# Altium schematic sheet Sheet1.SchDoc
size A3; SheetNumber: 2; SheetTotal: 2
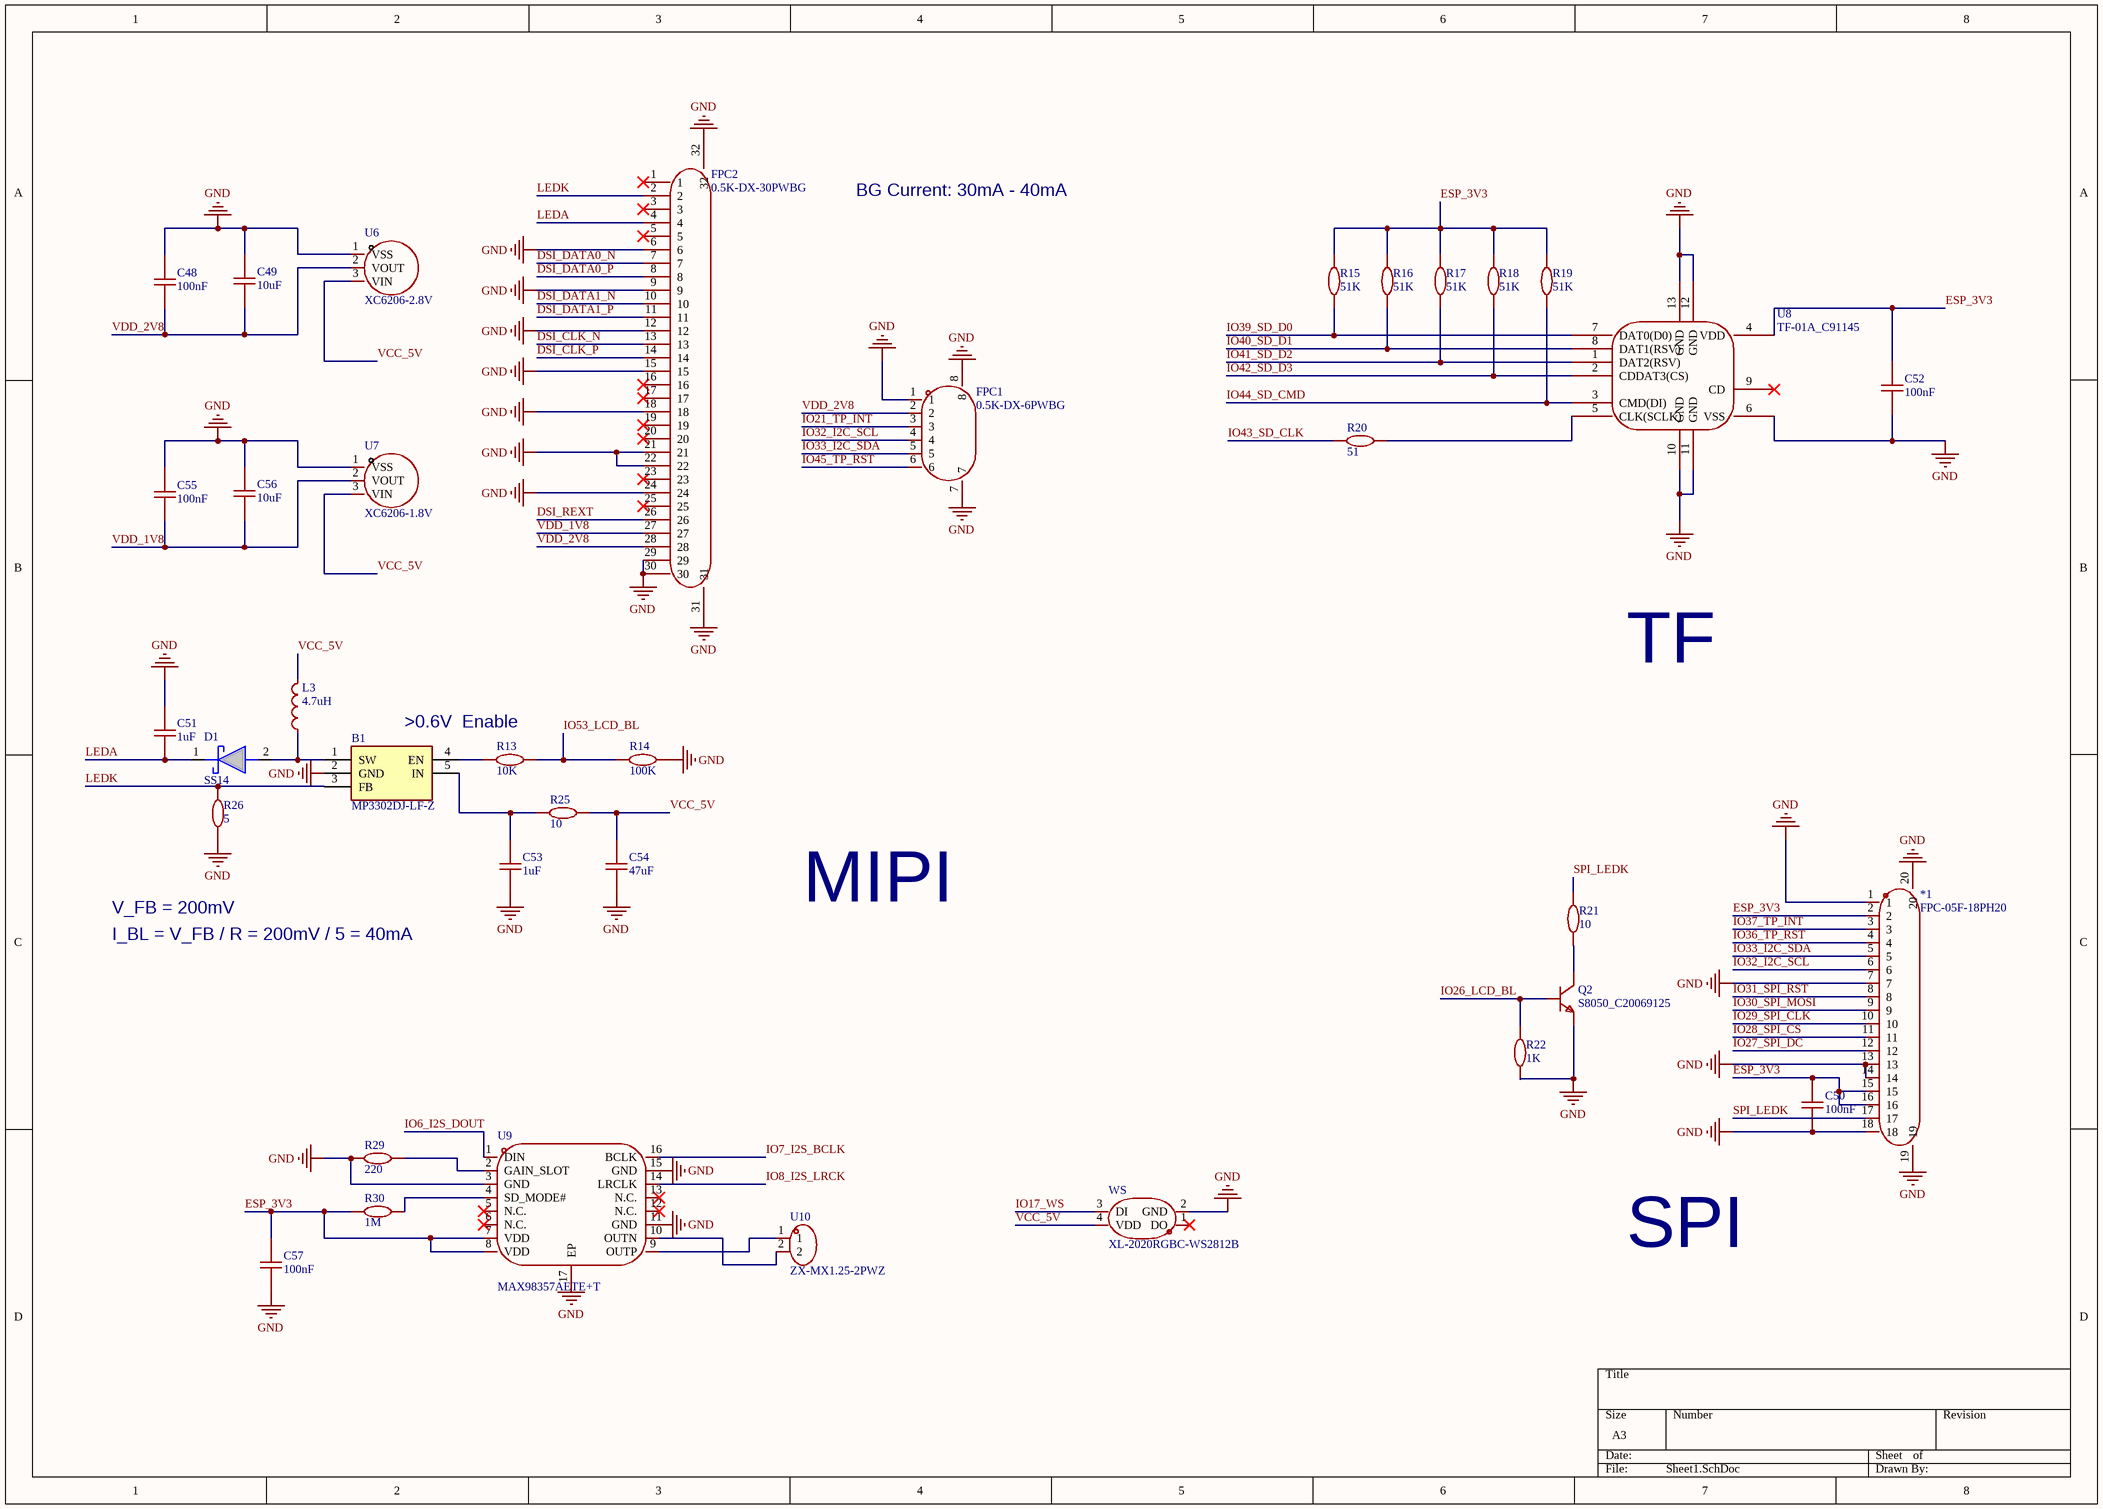
[diagram p0: Sheet1.SchDoc]

## Parts
*1  FPC-05F-18PH20  [FPC-SMD_18P-P0.50_FPC-05F-18PH20]
B1  MP3302DJ-LF-Z  [SOT95P280X100-5N]
C48  100nF  [C0402]
C49  10uF  [C0603]
C50  100nF  [C0402]
C51  1uF  [C0402]
C52  100nF  [C0402]
C53  1uF  [C0402]
C54  47uF  [C0603]
C55  100nF  [C0402]
C56  10uF  [C0603]
C57  100nF  [C0402]
D1  SS14  [DIOM5126X250N]
FPC1  0.5K-DX-6PWBG  [FPC-SMD_6P-P0.50_DEALON_0.5K-DX-6PWB]
FPC2  0.5K-DX-30PWBG  [FPC-SMD_6P-P0.50_DEALON_0.5K-DX-30PWB]
L3  4.7uH  [L0402-SMD]
Q2  S8050_C20069125  [SOT-23-3_L2.9-W1.3-P1.90-LS2.3-BR]
R13  10K  [R0402]
R14  100K  [R0402]
R15  51K  [R0402]
R16  51K  [R0402]
R17  51K  [R0402]
R18  51K  [R0402]
R19  51K  [R0402]
R20  51  [R0402]
R21  10  [R0402]
R22  1K  [R0402]
R25  10  [R0402]
R26  5  [R0402]
R29  220  [R0402]
R30  1M  [R0402]
U6  XC6206-2.8V  [SOT-23-3_L2.9-W1.6-P1.90-LS2.8-BR]
U7  XC6206-1.8V  [SOT-23-3_L2.9-W1.6-P1.90-LS2.8-BR]
U8  TF-01A_C91145  [TF-SMD_TF-01A]
U9  MAX98357AETE+T  [TQFN-16_L3.0-W3.0-P0.50-BL-EP1.5]
U10  ZX-MX1.25-2PWZ  [CONN-TH_2P-P1.25_ZX-MX1.25-2PWZ]
WS  XL-2020RGBC-WS2812B  [LED-SMD_4P-L2.0-W2.0-BR-1]

## Nets
GND: *1.1 *1.7 *1.13 *1.14 *1.18 *1.19 *1.20 B1.2(GND) C48.2 C49.2 C50.1 C51.2 C52.1 C53.1 C54.1 C55.2 C56.2 C57.1 FPC1.1 FPC1.7 FPC1.8 FPC2.6 FPC2.9 FPC2.12 FPC2.15 FPC2.18 FPC2.21 FPC2.22 FPC2.24 FPC2.29 FPC2.30 FPC2.31 FPC2.32 Q2.2(E) R14.1 R22.1 R26.2 R29.1 U6.1(VSS) U7.1(VSS) U8.6(VSS) U8.10(GND) U8.11(GND) U8.12(GND) U8.13(GND) U9.3(GND) U9.11(GND) U9.15(GND) U9.17(EP) WS.2(GND)
DSI_CLK_N: FPC2.13
DSI_CLK_P: FPC2.14
DSI_DATA0_N: FPC2.7
DSI_DATA0_P: FPC2.8
DSI_DATA1_N: FPC2.10
DSI_DATA1_P: FPC2.11
DSI_REXT: FPC2.26
ESP_3V3: *1.2 *1.15 *1.16 C50.2 C52.2 C57.2 R15.1 R16.1 R17.1 R18.1 R19.1 R30.1 U8.4(VDD) U9.7(VDD) U9.8(VDD)
IO6_I2S_DOUT: U9.1(DIN)
IO7_I2S_BCLK: U9.16(BCLK)
IO8_I2S_LRCK: U9.14(LRCLK)
IO17_WS: WS.3(DI)
IO21_TP_INT: FPC1.3
IO26_LCD_BL: Q2.1(B) R22.2
IO27_SPI_DC: *1.12
IO28_SPI_CS: *1.11
IO29_SPI_CLK: *1.10
IO30_SPI_MOSI: *1.9
IO31_SPI_RST: *1.8
IO32_I2C_SCL: *1.6 FPC1.4
IO33_I2C_SDA: *1.5 FPC1.5
IO36_TP_RST: *1.4
IO37_TP_INT: *1.3
IO39_SD_D0: R15.2 U8.7(DAT0(D0))
IO40_SD_D1: R16.2 U8.8(DAT1(RSV))
IO41_SD_D2: R17.2 U8.1(DAT2(RSV))
IO42_SD_D3: R18.2 U8.2(CDDAT3(CS))
IO43_SD_CLK: R20.1
IO44_SD_CMD: R19.2 U8.3(CMD(DI))
IO45_TP_RST: FPC1.6
IO53_LCD_BL: R13.1 R14.2
LEDA: C51.1 D1.1(K) FPC2.4
LEDK: B1.3(FB) FPC2.2 R26.1
SPI_LEDK: *1.17 R21.2
VCC_5V: C54.2 L3.2 R25.1 U6.3(VIN) U7.3(VIN) WS.4(VDD)
VDD_1V8: C55.1 C56.1 FPC2.27 U7.2(VOUT)
VDD_2V8: C48.1 C49.1 FPC1.2 FPC2.28 U6.2(VOUT)
NetB1_1: B1.1(SW) D1.2(A) L3.1
NetB1_4: B1.4(EN) R13.2
NetB1_5: B1.5(IN) C53.2 R25.2
NetQ2_3: Q2.3(C) R21.1
NetR20_2: R20.2 U8.5(CLK(SCLK))
NetR29_2: R29.2 U9.2(GAIN_SLOT)
NetR30_2: R30.2 U9.4(SD_MODE#)
NetU9_9: U9.9(OUTP) U10.1
NetU9_10: U9.10(OUTN) U10.2

Not connected (* = marked no-connect by the designer): FPC2 1* 3* 5* 16* 17* 19* 20* 23* 25*; U8 9(CD)*; U9 5(N.C.)* 6(N.C.)* 12(N.C.)* 13(N.C.)*; WS 1(DO)*

## Notes on the sheet
- BG Current: 30mA - 40mA
- TF
- >0.6V  Enable
- V_FB = 200mV
- MIPI
- I_BL = V_FB / R = 200mV / 5 = 40mA
- SPI

## Library data of the parts
B1 = MP3302DJ-LF-Z: LED Lighting Drivers 1.3A, 1.3MHz WLED Driver; Manufacturer_Name: Monolithic Power Systems (MPS); Geometry.Height: 1mm; Mouser Part Number: 946-MP3302DJLFZ; Mouser Price/Stock: https://www.mouser.co.uk/ProductDetail/Monolithic-Power-Systems-MPS/MP3302DJ-LF-Z?qs=rC7bBWoQAAmgkwFvMFHCAg%3D%3D; Manufacturer_Part_Number: MP3302DJ-LF-Z; Datasheet Link: https://componentsearchengine.com/Datasheets/1/MP3302DJ-LF-Z.pdf
C48 C50-C53 C55 C57 = C0402
C49 C54 C56 = C0603
D1 = SS14: TAIWAN SEMICONDUCTOR - SS14 - SCHOTTKY RECTIFIER, 1A, 40V, DO-214AC; Geometry.Height: 2.5mm; Mouser Part Number: 821-SS14; Mouser Price/Stock: https://www.mouser.co.uk/ProductDetail/Taiwan-Semiconductor/SS14?qs=JV7lzlMm3yLIdi0ESVd3YQ%3D%3D; Manufacturer_Name: Taiwan Semiconductor; Manufacturer_Part_Number: SS14; Datasheet Link: https://www.taiwansemi.com/assets/uploads/datasheet/SS12%20SERIES_Q2102.pdf
L3 = L0402-SMD
R13-R22 R25 R26 R29 R30 = R0402
U7 = XC6206-2.8V